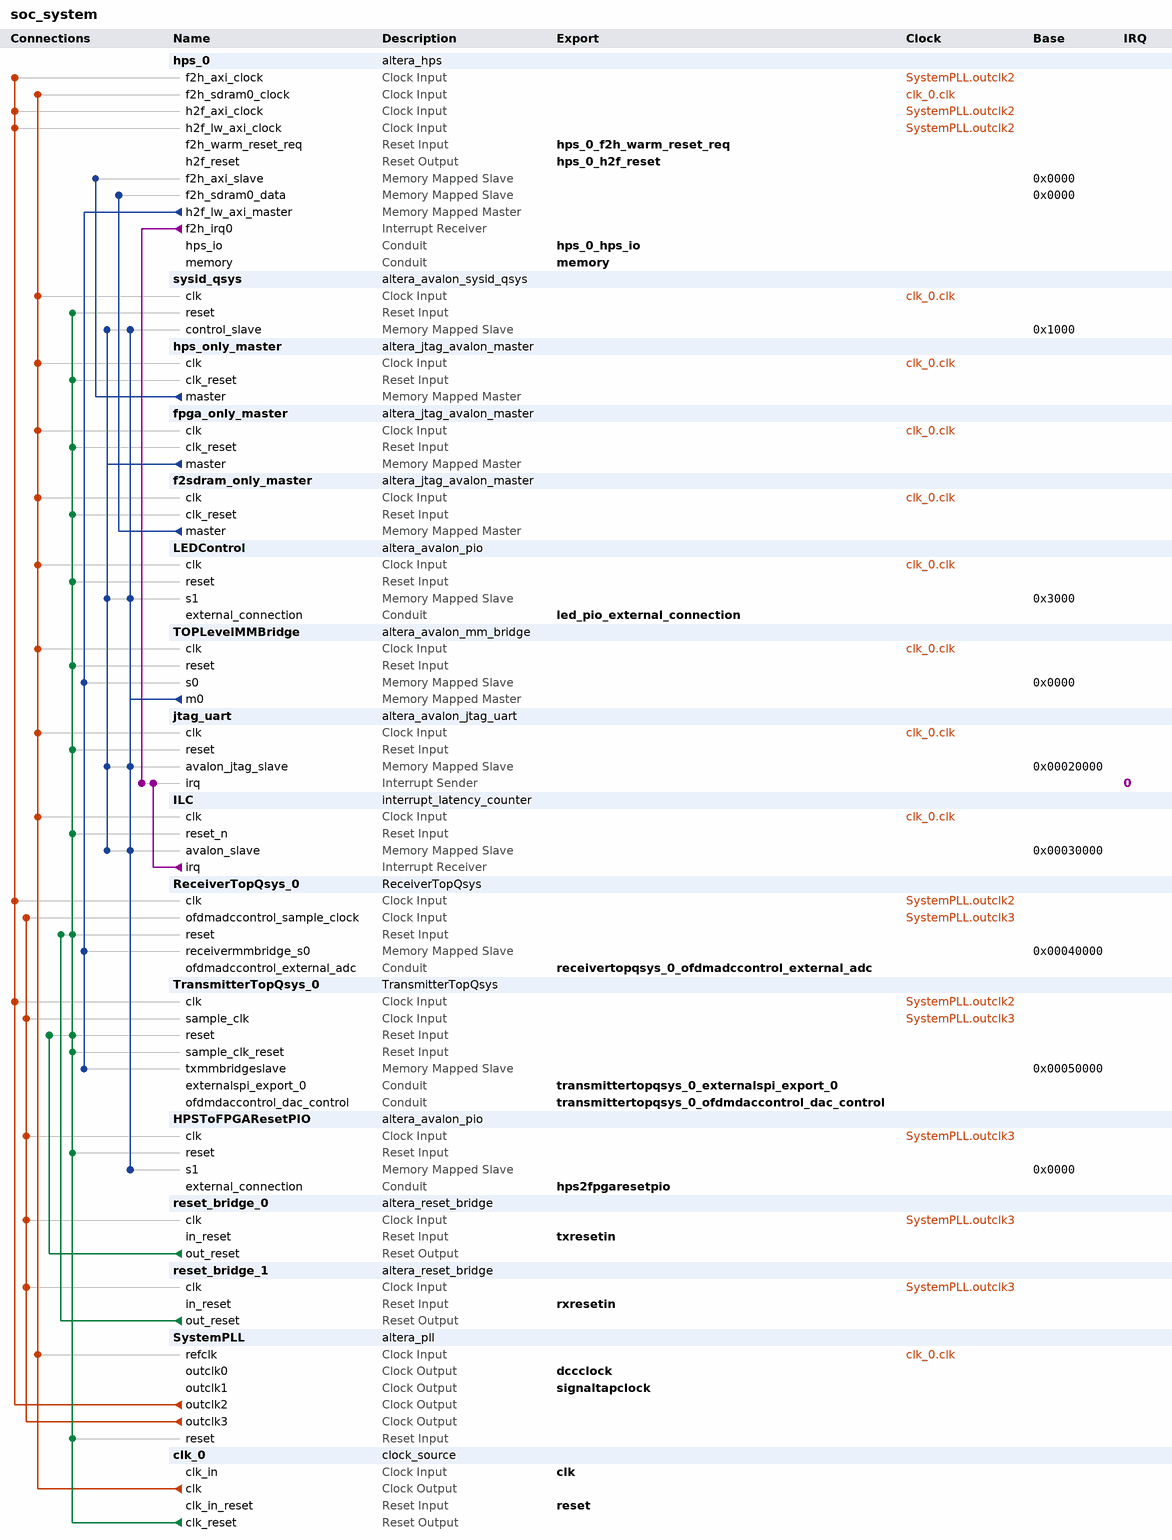
[diagram p0: system contents]
# Platform Designer (Qsys) system soc_system, Cyclone V 5CSXFC6D6F31C6
# Parameters at their usual value, and those the tool derives, are not listed.
package require -exact qsys 16.1
create_system soc_system
set_project_property DEVICE_FAMILY {Cyclone V}
set_project_property DEVICE 5CSXFC6D6F31C6

add_instance hps_0 altera_hps 16.1
set_instance_parameter_value hps_0 EMAC1_Mode RGMII
set_instance_parameter_value hps_0 EMAC1_PinMuxing {HPS I/O Set 0}
set_instance_parameter_value hps_0 F2SCLK_COLDRST_Enable false
set_instance_parameter_value hps_0 F2SCLK_DBGRST_Enable false
set_instance_parameter_value hps_0 F2SCLK_WARMRST_Enable true
set_instance_parameter_value hps_0 F2SDRAM_Type {Avalon-MM Bidirectional}
set_instance_parameter_value hps_0 F2SDRAM_Width 256
set_instance_parameter_value hps_0 F2SINTERRUPT_Enable true
set_instance_parameter_value hps_0 F2S_Width 2
set_instance_parameter_value hps_0 FPGA_PERIPHERAL_OUTPUT_CLOCK_FREQ_EMAC0_GTX_CLK 100
set_instance_parameter_value hps_0 FPGA_PERIPHERAL_OUTPUT_CLOCK_FREQ_EMAC0_MD_CLK 100.0
set_instance_parameter_value hps_0 FPGA_PERIPHERAL_OUTPUT_CLOCK_FREQ_EMAC1_GTX_CLK 100
set_instance_parameter_value hps_0 FPGA_PERIPHERAL_OUTPUT_CLOCK_FREQ_EMAC1_MD_CLK 100.0
set_instance_parameter_value hps_0 HPS_PROTOCOL DDR3
set_instance_parameter_value hps_0 I2C0_Mode I2C
set_instance_parameter_value hps_0 I2C0_PinMuxing {HPS I/O Set 0}
set_instance_parameter_value hps_0 I2C1_Mode I2C
set_instance_parameter_value hps_0 I2C1_PinMuxing {HPS I/O Set 0}
set_instance_parameter_value hps_0 LWH2F_Enable true
set_instance_parameter_value hps_0 MEM_BANKADDR_WIDTH 3
set_instance_parameter_value hps_0 MEM_CLK_FREQ 400.0
set_instance_parameter_value hps_0 MEM_COL_ADDR_WIDTH 10
set_instance_parameter_value hps_0 MEM_DQ_WIDTH 32
set_instance_parameter_value hps_0 MEM_DRV_STR RZQ/6
set_instance_parameter_value hps_0 MEM_ROW_ADDR_WIDTH 15
set_instance_parameter_value hps_0 MEM_RTT_NOM RZQ/6
set_instance_parameter_value hps_0 MEM_RTT_WR {Dynamic ODT off}
set_instance_parameter_value hps_0 MEM_TCL 11
set_instance_parameter_value hps_0 MEM_TFAW_NS 45.0
set_instance_parameter_value hps_0 MEM_TRAS_NS 35.0
set_instance_parameter_value hps_0 MEM_TRCD_NS 13.75
set_instance_parameter_value hps_0 MEM_TRFC_NS 260.0
set_instance_parameter_value hps_0 MEM_TRP_NS 13.75
set_instance_parameter_value hps_0 MEM_VENDOR Micron
set_instance_parameter_value hps_0 MEM_WTCL 7
set_instance_parameter_value hps_0 QSPI_Mode {1 SS}
set_instance_parameter_value hps_0 QSPI_PinMuxing {HPS I/O Set 0}
set_instance_parameter_value hps_0 REF_CLK_FREQ 25.0
set_instance_parameter_value hps_0 S2FCLK_USER2CLK 5
set_instance_parameter_value hps_0 S2F_Width 2
set_instance_parameter_value hps_0 SDIO_Mode {4-bit Data}
set_instance_parameter_value hps_0 SDIO_PinMuxing {HPS I/O Set 0}
set_instance_parameter_value hps_0 SPIM0_Mode {Single Slave Select}
set_instance_parameter_value hps_0 SPIM0_PinMuxing {HPS I/O Set 0}
set_instance_parameter_value hps_0 SPIM1_Mode {Single Slave Select}
set_instance_parameter_value hps_0 SPIM1_PinMuxing {HPS I/O Set 0}
set_instance_parameter_value hps_0 STM_Enable false
set_instance_parameter_value hps_0 TIMING_BOARD_AC_SKEW 0.02
set_instance_parameter_value hps_0 TIMING_BOARD_AC_TO_CK_SKEW 0.01
set_instance_parameter_value hps_0 TIMING_BOARD_DQ_TO_DQS_SKEW 0.05
set_instance_parameter_value hps_0 TIMING_BOARD_MAX_CK_DELAY 0.03
set_instance_parameter_value hps_0 TIMING_BOARD_MAX_DQS_DELAY 0.02
set_instance_parameter_value hps_0 TIMING_BOARD_SKEW_BETWEEN_DQS 0.06
set_instance_parameter_value hps_0 TIMING_BOARD_SKEW_CKDQS_DIMM_MAX 0.12
set_instance_parameter_value hps_0 TIMING_BOARD_SKEW_CKDQS_DIMM_MIN 0.06
set_instance_parameter_value hps_0 TIMING_BOARD_SKEW_WITHIN_DQS 0.01
set_instance_parameter_value hps_0 TIMING_TDH 65
set_instance_parameter_value hps_0 TIMING_TDQSCK 255
set_instance_parameter_value hps_0 TIMING_TDQSQ 125
set_instance_parameter_value hps_0 TIMING_TDS 30
set_instance_parameter_value hps_0 TIMING_TIH 140
set_instance_parameter_value hps_0 TIMING_TIS 190
set_instance_parameter_value hps_0 TIMING_TQSH 0.4
set_instance_parameter_value hps_0 UART0_Mode {No Flow Control}
set_instance_parameter_value hps_0 UART0_PinMuxing {HPS I/O Set 0}
set_instance_parameter_value hps_0 USB1_Mode SDR
set_instance_parameter_value hps_0 USB1_PinMuxing {HPS I/O Set 0}
set_instance_parameter_value hps_0 desired_cfg_clk_mhz 100.0
set_instance_parameter_value hps_0 desired_qspi_clk_mhz 400.0

add_instance sysid_qsys altera_avalon_sysid_qsys 16.1
set_instance_parameter_value sysid_qsys id -1395322110

add_instance hps_only_master altera_jtag_avalon_master 16.1

add_instance fpga_only_master altera_jtag_avalon_master 16.1

add_instance f2sdram_only_master altera_jtag_avalon_master 16.1

add_instance LEDControl altera_avalon_pio 16.1
set_instance_parameter_value LEDControl direction Output
set_instance_parameter_value LEDControl width 10

add_instance TOPLevelMMBridge altera_avalon_mm_bridge 16.1
set_instance_parameter_value TOPLevelMMBridge ADDRESS_UNITS SYMBOLS
set_instance_parameter_value TOPLevelMMBridge ADDRESS_WIDTH 10
set_instance_parameter_value TOPLevelMMBridge DATA_WIDTH 32
set_instance_parameter_value TOPLevelMMBridge MAX_PENDING_RESPONSES 4
set_instance_parameter_value TOPLevelMMBridge USE_AUTO_ADDRESS_WIDTH 1

add_instance jtag_uart altera_avalon_jtag_uart 16.1
set_instance_parameter_value jtag_uart allowMultipleConnections true
set_instance_parameter_value jtag_uart simInteractiveOptions INTERACTIVE_ASCII_OUTPUT

add_instance ILC interrupt_latency_counter 16.1

add_instance ReceiverTopQsys_0 ReceiverTopQsys 1.0

add_instance TransmitterTopQsys_0 TransmitterTopQsys 1.0

add_instance HPSToFPGAResetPIO altera_avalon_pio 16.1
set_instance_parameter_value HPSToFPGAResetPIO bitModifyingOutReg true
set_instance_parameter_value HPSToFPGAResetPIO direction Bidir
set_instance_parameter_value HPSToFPGAResetPIO resetValue 3
set_instance_parameter_value HPSToFPGAResetPIO width 2

add_instance reset_bridge_0 altera_reset_bridge 16.1
set_instance_parameter_value reset_bridge_0 ACTIVE_LOW_RESET 1
set_instance_parameter_value reset_bridge_0 SYNCHRONOUS_EDGES both

add_instance reset_bridge_1 altera_reset_bridge 16.1
set_instance_parameter_value reset_bridge_1 ACTIVE_LOW_RESET 1
set_instance_parameter_value reset_bridge_1 SYNCHRONOUS_EDGES both

add_instance SystemPLL altera_pll 16.1
set_instance_parameter_value SystemPLL gui_device_speed_grade 1
set_instance_parameter_value SystemPLL gui_number_of_clocks 4
set_instance_parameter_value SystemPLL gui_operation_mode direct
set_instance_parameter_value SystemPLL gui_output_clock_frequency0 200.0
set_instance_parameter_value SystemPLL gui_output_clock_frequency1 200.0
set_instance_parameter_value SystemPLL gui_output_clock_frequency2 100.0
set_instance_parameter_value SystemPLL gui_output_clock_frequency3 10.0
set_instance_parameter_value SystemPLL gui_pll_mode {Integer-N PLL}
set_instance_parameter_value SystemPLL gui_reference_clock_frequency 100.0
set_instance_parameter_value SystemPLL gui_use_locked true

add_instance clk_0 clock_source 16.1
set_instance_parameter_value clk_0 clockFrequency 50000000

# connections
add_connection clk_0.clk f2sdram_only_master.clk clock
add_connection clk_0.clk fpga_only_master.clk clock
add_connection clk_0.clk hps_0.f2h_sdram0_clock clock
add_connection clk_0.clk hps_only_master.clk clock
add_connection clk_0.clk ILC.clk clock
add_connection clk_0.clk jtag_uart.clk clock
add_connection clk_0.clk LEDControl.clk clock
add_connection clk_0.clk sysid_qsys.clk clock
add_connection clk_0.clk SystemPLL.refclk clock
add_connection clk_0.clk TOPLevelMMBridge.clk clock
add_connection SystemPLL.outclk2 hps_0.f2h_axi_clock clock
add_connection SystemPLL.outclk2 hps_0.h2f_axi_clock clock
add_connection SystemPLL.outclk2 hps_0.h2f_lw_axi_clock clock
add_connection SystemPLL.outclk2 ReceiverTopQsys_0.clk clock
add_connection SystemPLL.outclk2 TransmitterTopQsys_0.clk clock
add_connection SystemPLL.outclk3 HPSToFPGAResetPIO.clk clock
add_connection SystemPLL.outclk3 ReceiverTopQsys_0.ofdmadccontrol_sample_clock clock
add_connection SystemPLL.outclk3 reset_bridge_0.clk clock
add_connection SystemPLL.outclk3 reset_bridge_1.clk clock
add_connection SystemPLL.outclk3 TransmitterTopQsys_0.sample_clk clock
add_connection clk_0.clk_reset f2sdram_only_master.clk_reset reset
add_connection clk_0.clk_reset fpga_only_master.clk_reset reset
add_connection clk_0.clk_reset hps_only_master.clk_reset reset
add_connection clk_0.clk_reset HPSToFPGAResetPIO.reset reset
add_connection clk_0.clk_reset ILC.reset_n reset
add_connection clk_0.clk_reset jtag_uart.reset reset
add_connection clk_0.clk_reset LEDControl.reset reset
add_connection clk_0.clk_reset ReceiverTopQsys_0.reset reset
add_connection clk_0.clk_reset sysid_qsys.reset reset
add_connection clk_0.clk_reset SystemPLL.reset reset
add_connection clk_0.clk_reset TOPLevelMMBridge.reset reset
add_connection clk_0.clk_reset TransmitterTopQsys_0.reset reset
add_connection clk_0.clk_reset TransmitterTopQsys_0.sample_clk_reset reset
add_connection reset_bridge_0.out_reset TransmitterTopQsys_0.reset reset
add_connection reset_bridge_1.out_reset ReceiverTopQsys_0.reset reset
add_connection f2sdram_only_master.master hps_0.f2h_sdram0_data avalon
set_connection_parameter_value f2sdram_only_master.master/hps_0.f2h_sdram0_data baseAddress 0x0000
add_connection fpga_only_master.master ILC.avalon_slave avalon
set_connection_parameter_value fpga_only_master.master/ILC.avalon_slave baseAddress 0x00030000
add_connection fpga_only_master.master jtag_uart.avalon_jtag_slave avalon
set_connection_parameter_value fpga_only_master.master/jtag_uart.avalon_jtag_slave baseAddress 0x00020000
add_connection fpga_only_master.master LEDControl.s1 avalon
set_connection_parameter_value fpga_only_master.master/LEDControl.s1 baseAddress 0x3000
add_connection fpga_only_master.master sysid_qsys.control_slave avalon
set_connection_parameter_value fpga_only_master.master/sysid_qsys.control_slave baseAddress 0x1000
add_connection hps_0.h2f_lw_axi_master ReceiverTopQsys_0.receivermmbridge_s0 avalon
set_connection_parameter_value hps_0.h2f_lw_axi_master/ReceiverTopQsys_0.receivermmbridge_s0 baseAddress 0x00040000
add_connection hps_0.h2f_lw_axi_master TOPLevelMMBridge.s0 avalon
set_connection_parameter_value hps_0.h2f_lw_axi_master/TOPLevelMMBridge.s0 baseAddress 0x0000
add_connection hps_0.h2f_lw_axi_master TransmitterTopQsys_0.txmmbridgeslave avalon
set_connection_parameter_value hps_0.h2f_lw_axi_master/TransmitterTopQsys_0.txmmbridgeslave baseAddress 0x00050000
add_connection hps_only_master.master hps_0.f2h_axi_slave avalon
set_connection_parameter_value hps_only_master.master/hps_0.f2h_axi_slave baseAddress 0x0000
add_connection TOPLevelMMBridge.m0 HPSToFPGAResetPIO.s1 avalon
set_connection_parameter_value TOPLevelMMBridge.m0/HPSToFPGAResetPIO.s1 baseAddress 0x0000
add_connection TOPLevelMMBridge.m0 ILC.avalon_slave avalon
set_connection_parameter_value TOPLevelMMBridge.m0/ILC.avalon_slave baseAddress 0x00030000
add_connection TOPLevelMMBridge.m0 jtag_uart.avalon_jtag_slave avalon
set_connection_parameter_value TOPLevelMMBridge.m0/jtag_uart.avalon_jtag_slave baseAddress 0x00020000
add_connection TOPLevelMMBridge.m0 LEDControl.s1 avalon
set_connection_parameter_value TOPLevelMMBridge.m0/LEDControl.s1 baseAddress 0x3000
add_connection TOPLevelMMBridge.m0 sysid_qsys.control_slave avalon
set_connection_parameter_value TOPLevelMMBridge.m0/sysid_qsys.control_slave baseAddress 0x1000
add_connection hps_0.f2h_irq0 jtag_uart.irq interrupt
set_connection_parameter_value hps_0.f2h_irq0/jtag_uart.irq irqNumber 2
add_connection ILC.irq jtag_uart.irq interrupt
set_connection_parameter_value ILC.irq/jtag_uart.irq irqNumber 0

# exported interfaces
add_interface clk clock sink
set_interface_property clk EXPORT_OF clk_0.clk_in
add_interface dccclock clock source
set_interface_property dccclock EXPORT_OF SystemPLL.outclk0
add_interface hps2fpgaresetpio conduit end
set_interface_property hps2fpgaresetpio EXPORT_OF HPSToFPGAResetPIO.external_connection
add_interface hps_0_f2h_warm_reset_req reset sink
set_interface_property hps_0_f2h_warm_reset_req EXPORT_OF hps_0.f2h_warm_reset_req
add_interface hps_0_h2f_reset reset source
set_interface_property hps_0_h2f_reset EXPORT_OF hps_0.h2f_reset
add_interface hps_0_hps_io conduit end
set_interface_property hps_0_hps_io EXPORT_OF hps_0.hps_io
add_interface led_pio_external_connection conduit end
set_interface_property led_pio_external_connection EXPORT_OF LEDControl.external_connection
add_interface memory conduit end
set_interface_property memory EXPORT_OF hps_0.memory
add_interface receivertopqsys_0_ofdmadccontrol_external_adc conduit end
set_interface_property receivertopqsys_0_ofdmadccontrol_external_adc EXPORT_OF ReceiverTopQsys_0.ofdmadccontrol_external_adc
add_interface reset reset sink
set_interface_property reset EXPORT_OF clk_0.clk_in_reset
add_interface rxresetin reset sink
set_interface_property rxresetin EXPORT_OF reset_bridge_1.in_reset
add_interface signaltapclock clock source
set_interface_property signaltapclock EXPORT_OF SystemPLL.outclk1
add_interface transmittertopqsys_0_externalspi_export_0 conduit end
set_interface_property transmittertopqsys_0_externalspi_export_0 EXPORT_OF TransmitterTopQsys_0.externalspi_export_0
add_interface transmittertopqsys_0_ofdmdaccontrol_dac_control conduit end
set_interface_property transmittertopqsys_0_ofdmdaccontrol_dac_control EXPORT_OF TransmitterTopQsys_0.ofdmdaccontrol_dac_control
add_interface txresetin reset sink
set_interface_property txresetin EXPORT_OF reset_bridge_0.in_reset

set_interconnect_requirement {$system} qsys_mm.clockCrossingAdapter HANDSHAKE
set_interconnect_requirement {$system} qsys_mm.maxAdditionalLatency 1

save_system soc_system.qsys
